# EAGLE design Power_board (EAGLE 7.6.0)
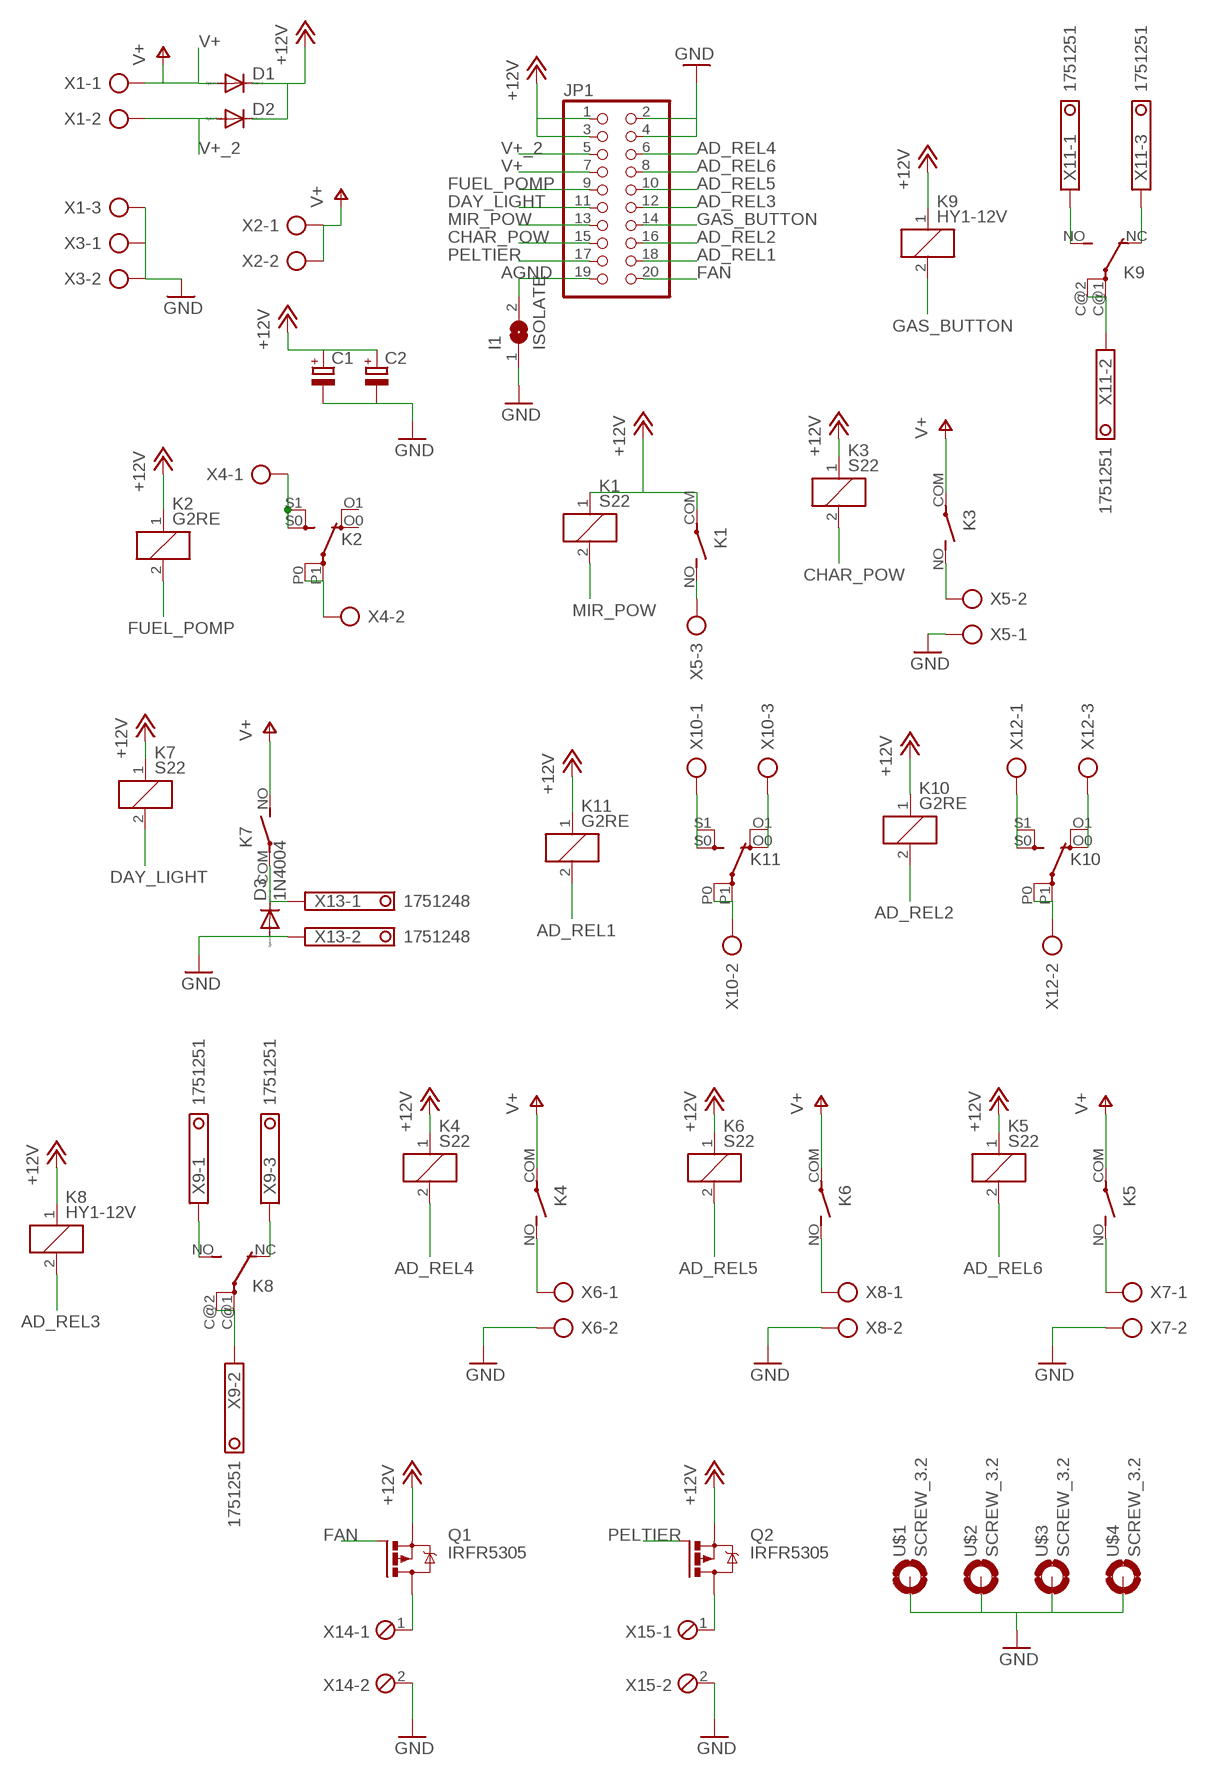
[diagram p0: schematic, sheet 1]

## Parts
C1  CAP_HORIZ  [C075-032X103]
C2  CAP_HORIZ  [C075-032X103]
D1  DIODE-P6-15  [P6-15]
D2  DIODE-P6-15  [P6-15]
D3  1N4004  [DO41-10]
I1  ISOLATE  [SJ]
JP1  PINHD-2X10  [2X10]
K1  S22  [LD]
K2  G2RE  [G2RE]
K3  S22  [LD]
K4  S22  [LD]
K5  S22  [LD]
K6  S22  [LD]
K7  S22  [LD]
K8  HY1-12V  [HY]
K9  HY1-12V  [HY]
K10  G2RE  [G2RE]
K11  G2RE  [G2RE]
Q1  IRFR5305  [D-PAK_TO252AA]
Q2  IRFR5305  [D-PAK_TO252AA]
U$1  SCREW_3.2  [3,2-PAD]
U$2  SCREW_3.2  [3,2-PAD]
U$3  SCREW_3.2  [3,2-PAD]
U$4  SCREW_3.2  [3,2-PAD]
X1  AK500/3  [AK500/3]
X2  AK500/2  [AK500/2]
X3  AK500/2  [AK500/2]
X4  AK500/2  [AK500/2]
X5  AK500/3  [AK500/3]
X6  AK500/2  [AK500/2]
X7  AK500/2  [AK500/2]
X8  AK500/2  [AK500/2]
X9  1751251  [1751251]
X10  AK500/3  [AK500/3]
X11  1751251  [1751251]
X12  AK500/3  [AK500/3]
X13  1751248  [1751248]
X14  MPT2  [2POL254]
X15  MPT2  [2POL254]

## Nets
+12V: C1.1(+) C2.1(+) D1.C D2.C JP1.1 JP1.3 K1.1 K1.COM(P) K2.1 K3.1 K4.1 K5.1 K6.1 K7.1 K8.1 K9.1 K10.1 K11.1 Q1.3(S) Q2.3(S)
AD_REL1: JP1.18 K11.2
AD_REL2: JP1.16 K10.2
AD_REL3: JP1.12 K8.2
AD_REL4: JP1.6 K4.2
AD_REL5: JP1.10 K6.2
AD_REL6: JP1.8 K5.2
AGND: I1.2 JP1.19
CHAR_POW: JP1.15 K3.2
DAY_LIGHT: JP1.11 K7.2
FAN: JP1.20 Q1.1(G)
FUEL_POMP: JP1.9 K2.2
GAS_BUTTON: JP1.14 K9.2
GND: C1.2(-) C2.2(-) D3.A I1.1 JP1.2 JP1.4 U$1.B3,2(MOUNT) U$2.B3,2(MOUNT) U$3.B3,2(MOUNT) U$4.B3,2(MOUNT) X1.3 X3.1 X3.2 X5.1 X6.2 X7.2 X8.2 X13.2 X14.2 X15.2
MIR_POW: JP1.13 K1.2
N$1: K1.NO(S) X5.3
N$2: K4.NO(S) X6.1
N$3: K3.NO(S) X5.2
N$4: K5.NO(S) X7.1
N$5: K6.NO(S) X8.1
N$6: Q1.4(D) X14.1
N$9: Q2.4(D) X15.1
N$18: K2.S0(2:S) K2.S1(2:S) X4.1
N$19: K2.P0(2:P) K2.P1(2:P) X4.2
N$54: D3.C K7.COM(P) X13.1
N$76: K8.NO(2:S) X9.1
N$79: K8.NC(2:O) X9.3
N$81: K8.C@1(2:P) K8.C@2(2:P) X9.2
N$82: K9.NO(2:S) X11.1
N$83: K9.NC(2:O) X11.3
N$84: K9.C@1(2:P) K9.C@2(2:P) X11.2
N$85: K10.S0(2:S) K10.S1(2:S) X12.1
N$86: K10.O0(2:O) K10.O1(2:O) X12.3
N$87: K10.P0(2:P) K10.P1(2:P) X12.2
N$88: K11.S0(2:S) K11.S1(2:S) X10.1
N$89: K11.O0(2:O) K11.O1(2:O) X10.3
N$90: K11.P0(2:P) K11.P1(2:P) X10.2
PELTIER: JP1.17 Q2.1(G)
V+: D1.A JP1.7 K3.COM(P) K4.COM(P) K5.COM(P) K6.COM(P) K7.NO(S) X1.1 X2.1 X2.2
V+_2: D2.A JP1.5 X1.2
Unconnected: K2.O0(2:O) K2.O1(2:O)

## Library data of the parts
C1 C2 = Stworzone:CAP_HORIZ
D1 D2 = diode:DIODE-: DIODE
D3 = diode:1N4004: DIODE general purpose rectifier, 1 A
I1 = Stworzone:ISOLATE
JP1 = pinhead:PINHD-2X10: PIN HEADER
K1 K3-K7 = Stworzone:S22
K2 K10 K11 = relay:G2RE: RELAY 1 x switch, high current, Omron; OC_FARNELL: unknown; OC_NEWARK: unknown
K8 K9 = relay:HY1*: Non-polarized 1 Form C Relay NAiS Source: http://www.mew-europe.com/.. en_ds_61012_0000.pdf; MF: AROMAT/ MATSUSHITA; MPN: HY1-12V; OC_FARNELL: unknown; OC_NEWARK: 10C6688
Q1 Q2 = transistor-power:IRF?5305: HEXFET Power MOSFET Source: http://www.irf.com/product-info/datasheets/data/irfr5305pbf.pdf
U$1-U$4 = Stworzone:SCREW_3.2
X1 X5 X10 X12 = con-ptr500:AK500/3: CONNECTOR; OC_FARNELL: unknown; OC_NEWARK: unknown
X2-X4 X6-X8 = con-ptr500:AK500/2: CONNECTOR; OC_FARNELL: unknown; OC_NEWARK: unknown
X9 X11 = con-phoenix-350:1751251: MKDS 1/ 3-3,5 Printklemme Nennstrom: 10 A Bemessungsspannung: 160 V Raster: 3,5 mm Polzahl: 3 Montageart: Löten Anschlussart: Schraubanschluss Anschlussrichtung vom Leiter zur Platine: 0° Source: http://eshop.phoenixcontact.com .. 1751251.pdf; OC_FARNELL: unknown; OC_NEWARK: unknown
X13 = con-phoenix-350:1751248: MKDS 1/ 2-3,5 Printklemme Nennstrom: 10 A Bemessungsspannung: 160 V Raster: 3,5 mm Polzahl: 2 Montageart: Löten Anschlussart: Schraubanschluss Anschlussrichtung vom Leiter zur Platine: 0° Source: http://eshop.phoenixcontact.com .. 1751248.pdf; OC_FARNELL: unknown; OC_NEWARK: unknown
X14 X15 = con-phoenix-254:MPT2: PHOENIX CONNECTOR; OC_FARNELL: unknown; OC_NEWARK: unknown

## Board
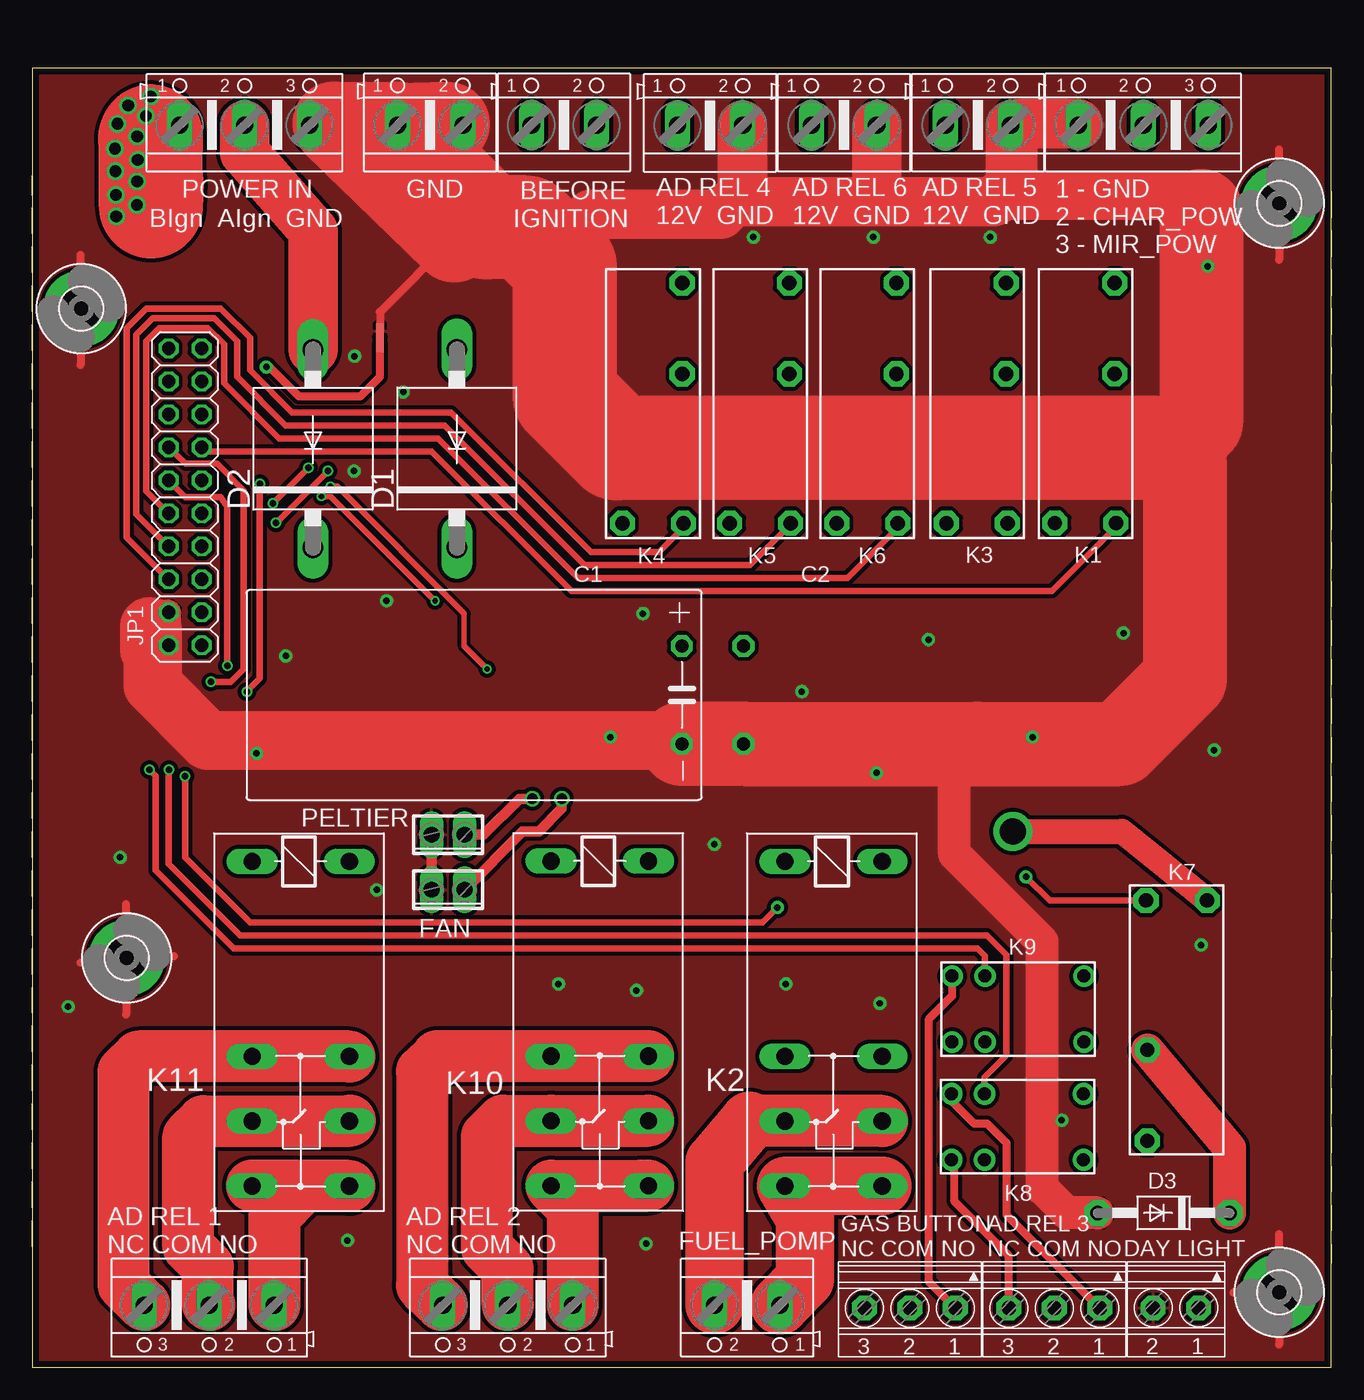
[diagram p1: board, top side]
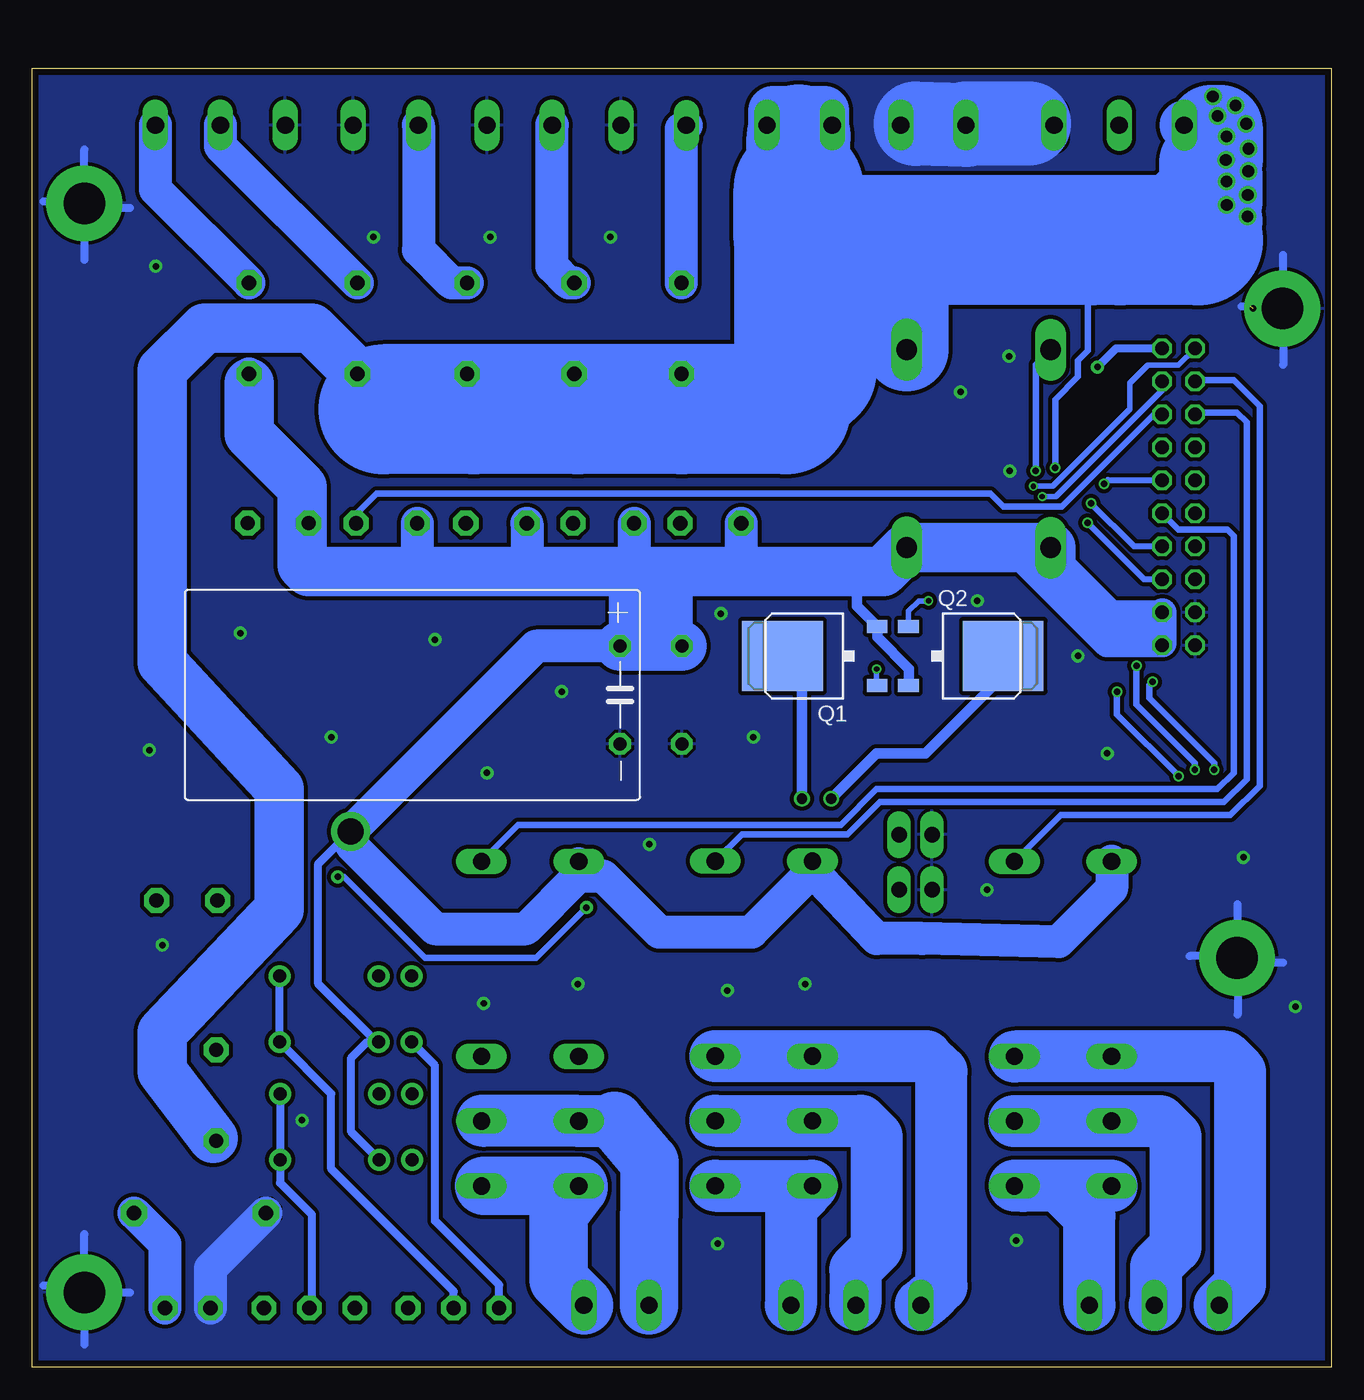
[diagram p2: board, bottom side, seen from below]

Size 100 x 100 mm. Coordinates in mm from the lower left corner, seen from the top.
Outline: 0,0 100,0 100,100 0,100 0,0
Copper layers (1*16): Top 0.035mm / dielectric 1.6mm / Bottom 0.035mm
Design rules "Elecrow_2-layer_PCB_eagle_rule": minimum track width 6mil, minimum drill 12mil, track to track 6mil, track to pad 6mil, pad to pad 6mil, via to via 8mil, smd to smd 0mil, copper to edge 20mil, drill to drill 10mil, minimum pad ring 6mil, minimum via ring 6mil, stop-mask expansion 0mil, vias tented up to drill 100mil, thermal gap 10mil

### Footprints (pad centres in the part's own frame; a part is rotated, then mirrored left to right if it is on the bottom)
C075-032X103 = drill 1 pad 1.676 octagon: 1 -3.76,5; 2 3.76,5
P6-15 = drill 1.6 long: A 7.62,0; C -7.62,0
DO41-10 = drill 1.118 pad 2.032 octagon: A 5.08,0; C -5.08,0
SJ = smd 1.168 x 0.6: 1 -0.512,0; 2 0.512,0
2X10 = drill 1.016 octagon: 1 -11.43,-1.27; 2 -11.43,1.27; 3 -8.89,-1.27; 4 -8.89,1.27; 5 -6.35,-1.27; 6 -6.35,1.27; 7 -3.81,-1.27; 8 -3.81,1.27; 9 -1.27,-1.27; 10 -1.27,1.27; 11 1.27,-1.27; 12 1.27,1.27; 13 3.81,-1.27; 14 3.81,1.27; 15 6.35,-1.27; 16 6.35,1.27; 17 8.89,-1.27; 18 8.89,1.27; 19 11.43,-1.27; 20 11.43,1.27
LD = drill 1.1 pad 1.93 octagon: 1 -9.2,2.25; 2 -9.2,-2.45; COM 2.3,-2.35; NO 9.3,-2.35
G2RE = drill 1.321 long: 1 -2.54,-3.683; 2 -2.54,3.81; O0 12.471,-3.683; O1 12.471,3.81; P0 17.45,-3.683; P1 17.45,3.81; S0 22.454,-3.683; S1 22.454,3.81
HY = drill 1 pad 1.676: 1 -2.54,-2.54; 2 -2.54,2.54; C@1 5.08,2.54; C@2 5.08,-2.54; NC -5.08,-2.54; NO -5.08,2.54
D-PAK_TO252AA = smd 1 x 1.6: 1 -2.28,-4.8; 3 2.28,-4.8 | smd 5.4 x 6.2: 4 0,2.5
3,2-PAD = drill 3.2 pad 5.842: B3,2 0,0
AK500/3 = drill 1.321 long: 1 -5.004,0; 2 0,0; 3 5.004,0
AK500/2 = drill 1.321 long: 1 -2.515,0; 2 2.515,0
1751251 = drill 1.1 pad 1.905 octagon: 1 -3.5,-0.1; 2 0,-0.1; 3 3.5,-0.1
1751248 = drill 1.1 pad 1.905 octagon: 1 -1.75,-0.1; 2 1.75,-0.1
2POL254 = drill 1.2 long: 1 -1.27,0; 2 1.27,0

### Placement (x,y rotation side)
C1  45,51.75 270 top
C2  59.75,51.75 270 bottom
D1  32.68,70.72 90 top
D2  21.6,70.71 90 top
D3  87.1,11.87 180 top
I1  26.75,79.25 270 top
JP1  11.75,67 90 top
K1  80.98,74.18 90 top
K2  61.62,36.39 270 top
K3  72.63,74.17 90 top
K4  47.68,74.17 90 top
K5  55.93,74.17 90 top
K6  64.18,74.17 90 top
K7  88.2,26.72 270 top
K8  75.85,18.5 0 top
K9  75.89,27.56 0 top
K10  43.62,36.41 270 top
K11  20.59,36.39 270 top
Q1  39.75,54.75 90 bottom
Q2  27.75,54.75 270 bottom
U$1  7.25,31.5 0 top
U$2  96,5.75 0 top
U$3  96,89.6 0 top
U$4  3.75,81.5 0 top
X1  16.33,95.62 0 top
X2  40.93,95.63 0 top
X3  30.63,95.63 0 top
X4  55.03,4.76 180 top
X5  85.53,95.63 0 top
X6  52.17,95.61 0 top
X7  62.49,95.62 0 top
X8  72.8,95.62 0 top
X9  78.68,4.44 180 top
X10  13.61,4.76 180 top
X11  67.57,4.44 180 top
X12  36.6,4.76 180 top
X13  88.04,4.45 180 top
X14  32,36.75 180 top
X15  32,41 180 top

### Tracks (layer width: path | path; a pad name or v marks a point on that pad's centre or on a via)
+12V  (via drill 2 pad 1.78)
  Top 1.93: v75.5,41.25 83.87,41.25 K7.1
  Bottom 0.5: 32,34 31.5,33
  Bottom 0.6: K9.1 73.52,25.02 | 73.52,25.02 74.23,25.02 75.5,23.75 75.5,18.15 K8.1 | 73.52,25.02 78,29.5 78,38.75 v75.5,41.25
  Bottom 0.813: Q2.3 32.5,52.52 32.5,53.75 34.95,56.2 Q1.3 36.5,58.58 36.5,61.25 | K10.1 39.94,38.19
  Bottom 1.778: JP1.1 JP1.3
  Bottom 2.184: JP1.3 13.02,55.77 13,55.75 17.25,55.75 23.75,62.25 23.75,63.1 | K2.1 57.94,37.81
  Bottom 2.54: K1.COM 83.33,75.77 | K1.1 79.02,64.98 79.25,64.75 | K3.1 70.38,61.87 71,61.25 | K6.1 61.93,61.43 61.75,61.25 | K5.1 53.68,61.32 53.75,61.25 | K4.1 45.43,61.68 45,61.25 | 52.39,59.56 52.75,59.56 52.75,61.25 | 14,57 13.75,57 13.25,57.5 13.25,57.75 17,57.75 | 17,57.75 17.25,58 | 17,57.75 15.75,56.5 13.5,56.5 13.25,56.25 13.25,57.25 | C2.1 61.24,55.51 v75.5,41.25 75.5,40.25 69,33.75 62,33.75 57.94,37.81 56.06,37.81 51.75,33.5 44.62,33.5 39.94,38.19 35,33 31.5,33 21,32.75 16.91,36.84 K11.1
  Bottom 3.81: 83.33,75.77 83.33,71.83 79.25,67.75 79.25,64.75 79.25,61.75 78.75,61.25 71,61.25 61.75,61.25 53.75,61.25 52.75,61.25 45,61.25 36.5,61.25 34.53,61.25 D1.C 23.75,63.1 D2.C 21.6,61.35 17.25,57 14,57 | C1.1 C2.1 52.26,55.51 52.25,55.5 52.25,56.04 52.38,56.17 52.38,56.66 52.4,56.93
  Bottom 6.452: 52.4,56.93 52.39,56.93 52.39,59.56
AD_REL1
  Bottom 0.5: JP1.18 10.39,76 7.5,76 5.5,74 5.5,44.75 7.75,42.5 20.83,42.5 K11.2
AD_REL2
  Bottom 0.5: JP1.16 10.35,73.5 7.25,73.5 6.5,72.75 6.5,45.25 8.25,43.5 34.75,43.5 37.25,41 45.38,41 K10.2
AD_REL3  (via drill 0.5 pad 0.41)
  Top 0.5: v10.5,46 10.5,38.75 16,33.25 73.5,33.25 75,31.75 75,24 73.31,22.31 K8.2 | v15,54 15,66.25 14.5,67 11.77,67 JP1.12
  Bottom 0.5: v10.5,46 10.5,46.5 15,51 v15,54
AD_REL4
  Top 0.5: K4.2 50.13,64.63 48.25,62.75 43,62.75 32.25,73.5 20,73.5 16.75,76.75 16.75,79.25 14.5,81.5 8.75,81.5 7.25,80 7.25,63.88 JP1.6
AD_REL5
  Top 0.5: K6.2 66.63,64.63 62.75,60.75 42,60.75 31.25,71.5 19,71.5 14.75,75.75 14.75,78.75 13.5,80 9.75,80 8.75,79 8.75,67.46 JP1.10
AD_REL6
  Top 0.5: K5.2 58.38,64.88 55.25,61.75 42.5,61.75 31.75,72.5 19.5,72.5 15.75,76.25 15.75,79 14,80.75 9.25,80.75 8,79.5 8,65.67 JP1.8
AGND  (via drill 0.5 pad 1)
  Top 0.5: v18,77 18.25,77
  Top 0.61: 18.25,77 20.5,74.75 25.25,74.75 26.75,76.25 I1.2
  Bottom 0.61: JP1.19 16.57,78.43 v18,77
CHAR_POW
  Bottom 0.5: K3.2 75.08,65.67 73.5,67.25 26.25,67.25 25.25,66.25 20.75,66.25 13.65,73.35 JP1.15
DAY_LIGHT  (via drill 0.5 pad 0.41, 0.5 pad 1)
  Top 0.5: v17.5,68 17.5,53 v16.5,52 | v11.75,45.5 11.75,39.25 16.75,34.25 56.22,34.25 v57.35,35.38 57.35,35.35 57.25,35.25 | v76.5,37.75 78.33,35.92 K7.2
  Bottom 0.5: JP1.11 17.21,68.29 v17.5,68 | v16.5,52 16.5,50.25 v11.75,45.5 | v76.5,37.75 76,37.75 69.75,31.5 61.23,31.5 v57.35,35.38
FAN  (via drill 0.4 pad 0.3)
  Top 0.406: v35,53.75 33.25,55.5 33.25,58 23.46,67.82 v22.94,67.82
  Bottom 0.406: JP1.20 11.76,77.15 14.1,77.15 15.5,75.75 15.5,73.75 21.44,67.82 v22.94,67.82 | Q1.1 35,52.52 v35,53.75
FUEL_POMP
  Bottom 0.5: JP1.9 11.77,64.5 8,64.5 7.5,64 7.5,45.75 8.75,44.5 35,44.5 37.75,41.75 62.61,41.75 K2.2
GAS_BUTTON  (via drill 0.5 pad 0.41)
  Top 0.5: K9.2 73.35,31.65 72.75,32.25 15.5,32.25 9.5,38.25 9.5,45.5 v9,46 | v13.75,52.75 15.25,52.75 16.25,53.75 16.25,67.5 14.24,69.56 11.8,69.56 JP1.14
  Bottom 0.5: v9,46 9,46.5 14,51.5 14,52.5 v13.75,52.75
GND  (via drill 0.5 pad 1)  (2 unrouted)
  Top 0.61: 32.38,86.87 26.75,81.24 I1.1 | 96,87.25 96,85.25 | 94,89.25 92.5,89.25 | 98.5,89.75 99.18,89.75 | 96,91.75 96,93.75 | 3.7,79.15 3.7,77.15 | 6.2,81.65 6.9,81.65 | 3.7,83.65 3.7,85.65 | 7.2,29.15 7.2,27.15 | 5.2,31.15 3.7,31.15 | 9.7,31.65 10.9,31.65 | 7.2,33.65 7.2,35.65 | 96,3.75 96,1.75 | 94,5.75 92.5,5.75 | 98.5,6.25 99.18,6.26 | 96,8.25 96,10.25
  Top 0.813: X15.2 X14.2
  Top 1.93: JP1.2 JP1.4 10.13,58.13 10,58 10,57.75
  Top 2.54: 10,57.75 10,55.75 9.75,55.75 9.5,56 | D3.A 79.63,11.87 77.75,13.75 77.75,32.75 71,39.5 71,46.24 72.75,47.99
  Top 3.81: X3.2 33.02,95.73 33,95.75 32,95.75 31.98,95.73 | 28,94.75 28,95.61 X3.1 | X6.2 54.69,90.44 54,89.75 | 40,85.75 43,88.75 53,88.75 54,89.75 | X7.2 65,90.75 64,89.75 | 64,89.75 54,89.75 | X8.2 75.31,91.06 74.5,90.25 | 74.25,90 74,89.75 64,89.75 | 9.5,56 9.5,57.25 8.75,57.25 9,56 9.25,55.75 | 90,89 90,89.25 89,90.25 74.5,90.25 | 74.5,90.25 74.25,90 | 74.25,90 74.5,90 75.5,91 75.5,95.5 75.75,95.75 80.51,95.75 X5.1
  Top 4.5: 9.25,55.75 9.25,56.75 9,57 9,55.75 9.25,55.5 9,55.25 9.25,55 9.25,52.5 13.5,48.25 50.24,48.25 50.5,47.99
  Top 6.452: 31.98,95.73 X3.1 | X3.1 25.52,95.73 25.52,94.02 25.25,93.75 25.5,93.75 32.5,86.75 32.38,86.87 23.25,95.75 28.09,95.75 X3.1 | 90,89 90,72.75 88,70.75 | 87.5,70.75 88.75,69.5 88.75,53 83.74,47.99 72.75,47.99 C2.2 50.5,47.99 C1.2
  Top 8: 88,70.75 87.5,70.75 45,70.75 41,74.75 41,84.75 40,85.75 38,87.75 35,87.75 28,94.75
  Bottom 0.6: X1.3 21.97,95.72
  Bottom 0.61: 96,87.25 96,85.25 | 94,89.25 92.5,89.25 | 98.5,89.75 99.17,89.75 | 96,91.75 96,93.75 | 3.7,79.15 3.7,77.15 | 6.2,81.65 6.9,81.65 | 3.7,83.65 3.7,85.65 | 7.2,29.15 7.2,27.15 | 5.2,31.15 3.7,31.15 | 9.7,31.65 10.9,31.65 | 7.2,33.65 7.2,35.65 | 96,3.75 96,1.75 | 94,5.75 92.5,5.75 | 98.5,6.25 99.17,6.26 | 96,8.25 96,10.25
  Bottom 2.54: X13.2 86.29,7.6 D3.A
  Bottom 3.81: 21.97,95.72 23.25,95.75
  Bottom 6.452: 23.25,95.75 28.09,95.75 X3.1 31.98,95.73 32,95.75
  other vias: 6,81.5 24.8,77.83 24.75,69 55.5,87 64.75,87 73.75,87 90.5,84.75 19.5,54.75 27.25,59 17.25,47.25 44.5,48.5 47,58 59.25,52 65,45.75 69,56 84,56.5 77,48.5 91,47.5 90,32.5 79.25,19 65.25,28 58,29.5 46.5,29 40.5,29.5 47.25,9.5 24.25,9.75 6.75,39.25 2.75,27.75 26.5,36.75 52.5,40.25 28.55,75.08
  pour Bottom (isolate 0.305): 0,100 100,100 100,0 0,0
  pour Top (isolate 0.305): 0,100 100,100 100,0 0,0
MIR_POW
  Top 0.5: K1.2 83.43,64.68 78.5,59.75 41.5,59.75 30.75,70.5 13.35,70.5 JP1.13
N$1
  Bottom 2.54: X5.3 90.53,90.68 K1.NO
N$2
  Bottom 2.54: K4.NO 50.03,95.33 X6.1
N$3
  Bottom 2.54: X5.2 85.53,94.02 K3.NO
N$4
  Bottom 2.54: K5.NO 58.72,83.47 60,84.75 60,95.69 X7.1
N$5
  Bottom 2.54: K6.NO 67.72,83.47 70.28,86.03 X8.1
N$6  (via drill 0.8 pad 0.41)
  Top 0.813: v40.75,43.75 40.75,43 39,41.25 37.75,41.25 37.75,41.23 X14.1
  Bottom 0.813: Q1.4 40.75,53.25 v40.75,43.75
N$9  (via drill 0.8 pad 0.41)
  Top 0.813: X15.1 34.75,41 37.5,43.75 v38.5,43.75
  Bottom 0.813: Q2.4 25.25,53.25 31.25,47.25 35,47.25 v38.5,43.75
N$18
  Top 4.5: K2.S1 65.4,13.97 58,13.97 59.5,11.47 59.5,6.75 57.55,4.79 X4.1
  Bottom 4.5: X4.1 59.5,6.71 59.5,11.75 57.94,13.81 K2.S0 57.97,13.97 65.21,13.97
N$19
  Top 4: K2.P1 55.19,18.94 | 52.5,4.78 X4.2
  Top 4.5: 55.19,18.94 52.5,15.75 52.5,4.78
  Bottom 4: 52.52,11.73 52.5,11.75 | 55.19,18.94 K2.P0 65.38,18.96 65.13,18.96
  Bottom 4.5: X4.2 52.52,11.73 | 52.5,11.75 52.5,15.75 55.19,18.94
N$54
  Top 2.54: D3.C 92.18,16.84 K7.COM
  Bottom 2.54: X13.1 89.79,9.48 D3.C
N$76
  Top 0.6: K8.NO 70.77,20.48 72.5,18.75 73.5,18.75 75,17.25 75,11.72 X9.1
N$79
  Top 0.6: X9.3 75.18,8.57 71,12.75 71,15.73 K8.NC
N$81
  Bottom 0.6: K8.C@1 K8.C@2 80.93,14.18 78.5,11.75 78.5,4.72 X9.2
N$82
  Top 0.6: K9.NO 70.81,28.56 69,26.75 69,6.61 X11.1
N$83
  Bottom 0.6: X11.3 64.07,6.32 69,11.25 69,23.21 K9.NC
N$84
  Bottom 0.6: X11.2 67.57,5.82 77,15.25 77,21.05 K9.C@2 K9.C@1
N$85
  Top 4: X12.1 41.6,12.29 K10.S0 46.84,13.96 47.41,13.96
  Bottom 4: K10.S1 40,13.96 40.5,13.39 41.6,12.29 X12.1
N$86
  Top 4: K10.O1 31.19,23.94 30,22.75 29.99,6.32 30.26,5.97 31.53,4.79
  Bottom 4: X12.3 30.99,5.26 30,6.25 30,22.75 31.19,23.94 K10.O0 K10.O1
N$87
  Top 4: X12.2 36.6,7.55 35,9.15 35,17.75 36.21,18.96 K10.P0 K10.P1
  Bottom 4: K10.P1 36.21,18.96 35,17.75 35,9.15 36.64,7.51 36.64,4.85 36.65,5.34
N$88
  Top 4: K11.S1 16.9,13.97 17.5,13.96 20.29,13.96 20.62,13.63 18.61,11.62 X10.1
  Bottom 4: X10.1 18.61,11.62 20.95,13.96 16.93,13.96 K11.S0 23.74,13.94 24.39,13.96
N$89
  Top 4: K11.O1 8.17,23.92 7,22.75 7,6.37 X10.3
  Bottom 0.5: 24.36,23.91 K11.O0
  Bottom 4: X10.3 7,6.37 7,22.75 8.16,23.91 24.36,23.91
N$90
  Top 4: X10.2 13.5,4.87 13.5,7.75 12,9.25 12,17.75 13.18,18.93 24.45,18.96
  Bottom 4: K11.P1 K11.P0 13.19,18.94 13.12,18.88 12,17.75 12,9.25 13.5,7.75 13.5,4.87 X10.2
PELTIER  (via drill 0.4 pad 0.3)
  Top 0.406: v31,59 22.95,67.03 v22.25,67.03
  Bottom 0.406: Q2.1 32.55,58.2 31.75,59 v31,59 | JP1.17 13.02,75.23 21.21,67.03 v22.25,67.03
V+  (via drill 0.5 pad 0.41, 0.9)
  Top 0.5: v18.5,66.5 v21.25,69.25
  Top 1.93: 7.5,89.49 v8.04,89.49 8.04,92.68 X1.1 | 7.5,89.49 7.34,89.49 v6.45,88.6 | v8.06,91.3 8.06,92.7 X1.1 | X1.1 8.31,92.95 v8.11,92.95 7.24,92.08 v6.38,92.08 6.38,93.79 v6.36,93.81 | v6.42,90.26 6.73,90.26 7.5,89.49 | v6.54,95.73 7.08,95.73 | 7.08,95.73 v8.06,94.75 9.12,94 | 9.12,94 9.61,94.75 X1.1 | 7.08,95.73 7.33,97.09 v7.37,97.13 | v9.11,97.84 9.06,96.66 v8.74,96.33 9.41,96.34 10,95.75 10.55,95.75 X1.1 | 9,88.75 10,94.75 11,95.75 9.62,95.75 9.12,94
  Top 2.184: 9,88.75 8.57,89.75
  Top 6.452: 8.57,89.75 9.17,90.15
  Top 8: 9.17,90.15 9.17,91.3 9.12,89.35 9.12,94 9.12,94.76 9.05,94.58
  Bottom 0.5: JP1.7 15.21,63.21 v18.5,66.5 | 16,86.5 16.25,86.75 | X2.1 X2.2 43.02,95.73 43,95.75 | v21.25,69.25 21.25,74.5 19.5,76.25 19.5,77.5 18.75,78.25 18.75,86.5 18.5,86.75
  Bottom 10: 10.25,86.75 16.25,86.75 18.5,86.75 33,86.75 40,86.75 | 41,90.75 41,86.75 40,86.75 | 40,86.75 40,76.75 42,74.75 | 42,73.75 50,73.75 58,73.75 66,73.75 73,73.75
  Bottom 2.54: K4.COM 50.03,73.78 50,73.75 | K5.COM 58.28,74.03 58,73.75 | K6.COM 66.53,74.28 66,73.75 | K3.COM 74.98,75.73 73,73.75 | K7.NO 86.1,17.6
  Bottom 3.81: X1.1 10.03,95.72 10,95.75 9.25,95.5 | 41,94.75 40,94.75 39,95.75 39,96.75 43,96.75 43,95.75 | 86.1,17.6 90,22.75 90,25.75 81,35.25 81,44.5 90,54.25 90,76.75 86.75,80 78.51,80 K3.COM
  Bottom 6.452: 9.25,95.5 8.5,95.5 8.5,92.75 9,91.75 | 9,89.75 8.5,89.75 8.5,91.75 10,91.75 10,92.75 9,93.75 9,91.75 | 9,91.75 11,89.75 9,89.75 | 9,89.75 8.5,88.25 10.25,86.75 | D1.A 32.68,86.43 33,86.75
  Bottom 8: 41,90.75 41,94.75 | 42,74.75 42,75.75 | 42,87.75 42,75.75 | 42,75.75 43,74.75 42,73.75
V+_2  (via drill 0.5 pad 0.41)
  Top 0.5: v18.75,65 v22.75,69
  Top 3.81: X1.2 16.33,93.51 21.6,87.49 D2.A
  Bottom 0.5: JP1.5 14.42,60.67 v18.75,65 | v22.75,69 22.75,77.18 D2.A

### Text on the board
tNames: POWER IN | GND | BIgn AIgn GND | BEFORE / IGNITION | AD REL 4 / 12V GND | AD REL 6 / 12V GND | AD REL 5 / 12V GND | 1 - GND / 2 - CHAR_POW / 3 - MIR_POW | PELTIER | FAN | AD REL 1 / NC COM NO | AD REL 2 / NC COM NO | FUEL_POMP | GAS BUTTON / NC COM NO | AD REL 3 / NC COM NO | DAY LIGHT